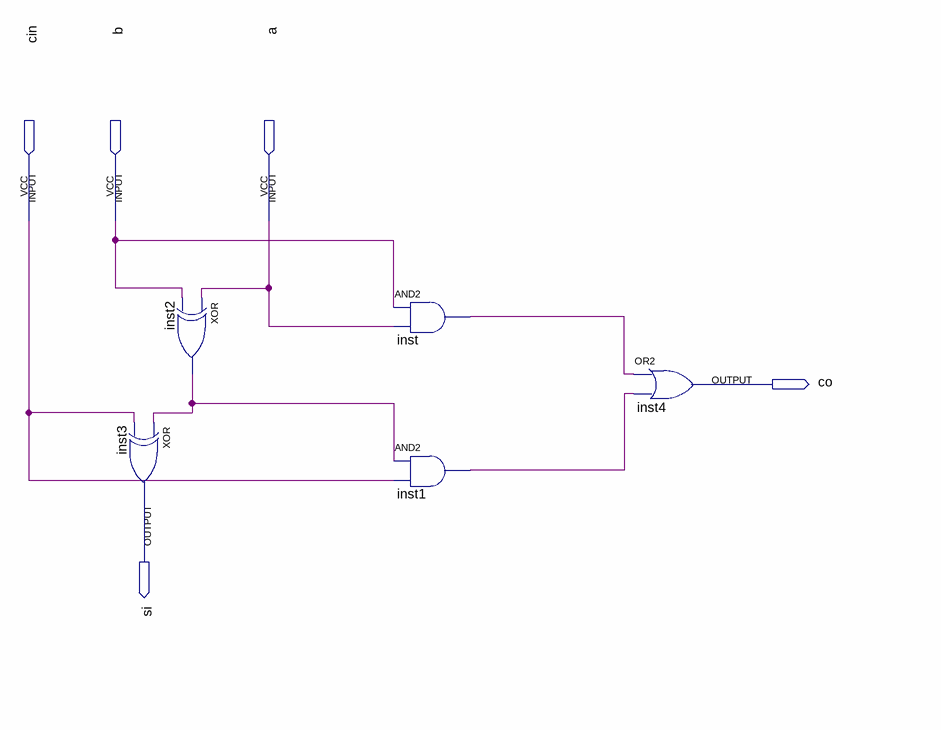
[diagram p0: schematic sheet]
// Quartus schematic test.bdf as structural Verilog: 5 symbols, 5 pins
module test (
  input  cin,
  input  b,
  input  a,
  output co,
  output si
);

  wire inst1_out, inst2_out, inst_out;

  xor inst2 (inst2_out, a, b);
  xor inst3 (si, inst2_out, cin);
  and inst (inst_out, b, a);
  and inst1 (inst1_out, inst2_out, cin);
  or inst4 (co, inst_out, inst1_out);
endmodule
